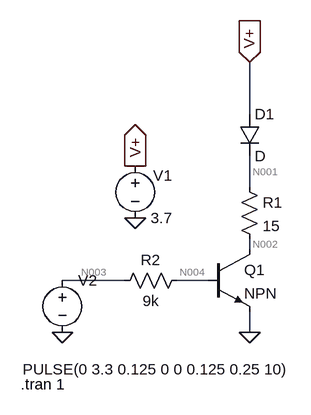
[diagram p0: schematic Sensor and Emitter.asc]
Sensor and Emitter.asc, the LTspice schematic file:
Version 4
SHEET 1 880 680
WIRE 112 16 112 -64
WIRE 112 128 112 80
WIRE 112 224 112 208
WIRE -80 272 -176 272
WIRE 48 272 0 272
WIRE 112 352 112 320
FLAG -64 96 V+
IOPIN -64 96 Out
FLAG -64 176 0
FLAG 112 -64 V+
IOPIN 112 -64 In
FLAG 112 352 0
FLAG -176 352 0
SYMBOL voltage -64 80 R0
WINDOW 0 28 30 Left 2
SYMATTR InstName V1
SYMATTR Value 3.7
SYMBOL npn 48 224 R0
SYMATTR InstName Q1
SYMBOL voltage -176 256 R0
WINDOW 3 -61 153 Left 2
WINDOW 123 0 0 Left 0
WINDOW 39 0 0 Left 0
SYMATTR InstName V2
SYMATTR Value PULSE(0 3.3 0.125 0 0 0.125 0.25 10)
SYMBOL res 96 112 R0
SYMATTR InstName R1
SYMATTR Value 15
SYMBOL res 16 256 R90
WINDOW 0 0 56 VBottom 2
WINDOW 3 32 56 VTop 2
SYMATTR InstName R2
SYMATTR Value 9k
SYMBOL diode 96 16 R0
SYMATTR InstName D1
TEXT -240 432 Left 2 !.tran 1

The netlist it stands for:
* Sensor and Emitter.asc
V1 V+ 0 3.7
Q1 N002 N004 0 0 NPN
V2 N003 0 PULSE(0 3.3 0.125 0 0 0.125 0.25 10)
R1 N001 N002 15
R2 N004 N003 9k
D1 V+ N001 D
.model D D
.lib standard.dio
.model NPN NPN
.model PNP PNP
.lib standard.bjt
.tran 1
.backanno
.end

* Results of the author's LTspice run, read from the files saved beside the schematic
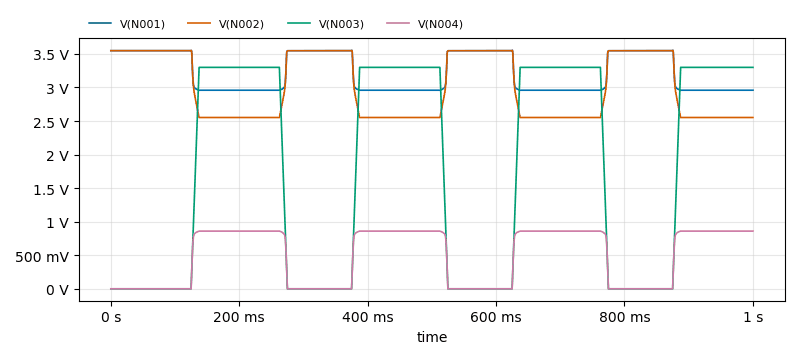
[diagram p1: Transient Analysis of Sensor and Emitter.asc, plotted from the saved traces]
* Transient Analysis, 1 run:
*   V(N001): min 2.96 V, max 3.553 V, average 3.221 V, rms 3.234 V, last 2.96 V
*   V(N002): min 2.553 V, max 3.553 V, average 3.009 V, rms 3.048 V, last 2.553 V
*   V(N003): min 0 V, max 3.3 V, average 1.753 V, rms 2.373 V, last 3.3 V
*   V(N004): min 0 V, max 859.6 mV, average 482.2 mV, rms 640.4 mV, last 859.6 mV